# Altium schematic sheet POWER.SchDoc
size B; Organization: Altium Limited; Address1: L3, 12a Rodborough Rd; Address2: Frenchs Forest; Address3: NSW; Address4: Australia 2086
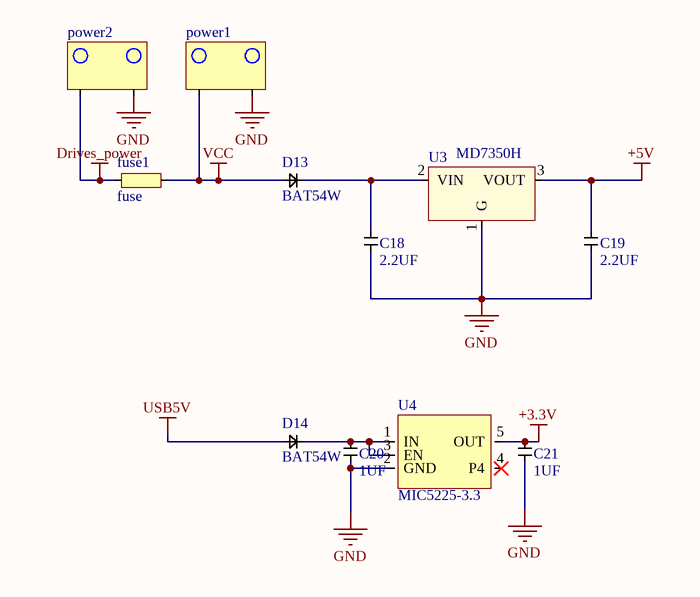
[diagram p0: POWER.SchDoc]

## Parts
C18  2.2UF  [1206]
C19  2.2UF  [1206]
C20  1UF  [0603]
C21  1UF  [0603]
D13  BAT54W  [SOD-123]
D14  BAT54W  [SOD-123]
fuse1  fuse  [保险丝小号]
power1  KF-7.62-2P  [TERMINALBLOCK_BORNIER-2_P5.08MM_2]  (value not drawn)
power2  KF-7.62-2P  [TERMINALBLOCK_BORNIER-2_P5.08MM_2]  (value not drawn)
U3  MD7350H  [SOT-89]
U4  MIC5225-3.3  [SOT23-5]

## Nets
+3.3V: C21.1 U4.5(OUT)
+5V: C19.1 U3.3(VOUT)
Drives_power: fuse1.1 power2.1
GND: C18.2 C19.2 C20.2 C21.2 power1.2 power2.2 U3.1(G) U4.2(GND)
USB5V: D14.1
VCC: D13.1 fuse1.2 power1.1
NetC18_1: C18.1 D13.2 U3.2(VIN)
NetC20_1: C20.1 D14.2 U4.1(IN) U4.3(EN)

Not connected (* = marked no-connect by the designer): U4 4(P4)*

## Notes on the sheet
- Title
- Size:
- Date:
- B
- Number:
- Time:
- Revision:
- Sheet
- of
- File:

## Library data of the parts
C18-C21 = C
D13 D14 = Diode: BAT46W